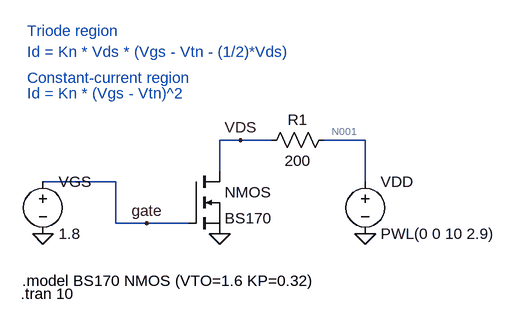
[diagram p0: schematic Draft47.asc]
Draft47.asc, the LTspice schematic file:
Version 4
SHEET 1 1392 3408
WIRE 240 48 208 48
WIRE 288 48 240 48
WIRE 432 48 368 48
WIRE 208 96 208 48
WIRE 48 112 -64 112
WIRE 432 112 432 48
WIRE 48 176 48 112
WIRE 96 176 48 176
WIRE 160 176 96 176
FLAG -64 192 0
FLAG 208 192 0
FLAG 432 192 0
FLAG 96 176 gate
FLAG 240 48 VDS
SYMBOL voltage -64 96 R0
WINDOW 123 0 0 Left 0
WINDOW 39 0 0 Left 0
SYMATTR InstName VGS
SYMATTR Value 1.8
SYMBOL voltage 432 96 R0
WINDOW 123 0 0 Left 0
WINDOW 39 0 0 Left 0
SYMATTR InstName VDD
SYMATTR Value PWL(0 0 10 2.9)
SYMBOL nmos 160 96 R0
SYMATTR InstName NMOS
SYMATTR Value BS170
SYMBOL res 384 32 R90
WINDOW 0 0 56 VBottom 2
WINDOW 3 32 56 VTop 2
SYMATTR InstName R1
SYMATTR Value 200
TEXT -96 264 Left 2 !.model BS170 NMOS (VTO=1.6 KP=0.32)
TEXT -88 -88 Left 2 ;Id = Kn * Vds * (Vgs - Vtn - (1/2)*Vds)
TEXT -88 -24 Left 2 ;Id = Kn * (Vgs - Vtn)^2
TEXT -88 -120 Left 2 ;Triode region
TEXT -88 -48 Left 2 ;Constant-current region
TEXT -98 284 Left 2 !.tran 10

The netlist it stands for:
* Draft47.asc
VGS gate 0 1.8
VDD N001 0 PWL(0 0 10 2.9)
M§NMOS VDS gate 0 0 BS170
R1 N001 VDS 200
.model NMOS NMOS
.model PMOS PMOS
.lib standard.mos
.model BS170 NMOS (VTO=1.6 KP=0.32)
* Id = Kn * Vds * (Vgs - Vtn - (1/2)*Vds)
* Id = Kn * (Vgs - Vtn)^2
* Triode region
* Constant-current region
.tran 10
.backanno
.end

* Results of the author's LTspice run, read from the files saved beside the schematic
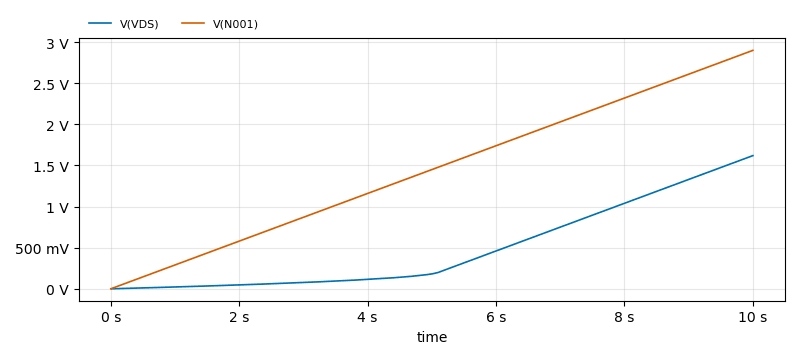
[diagram p1: Transient Analysis of Draft47.asc, plotted from the saved traces]
* Transient Analysis, 1 run:
*   V(VDS): min 0 V, max 1.62 V, average 482.1 mV, rms 796.4 mV, last 1.62 V
*   V(N001): min 0 V, max 2.9 V, average 1.45 V, rms 1.717 V, last 2.9 V